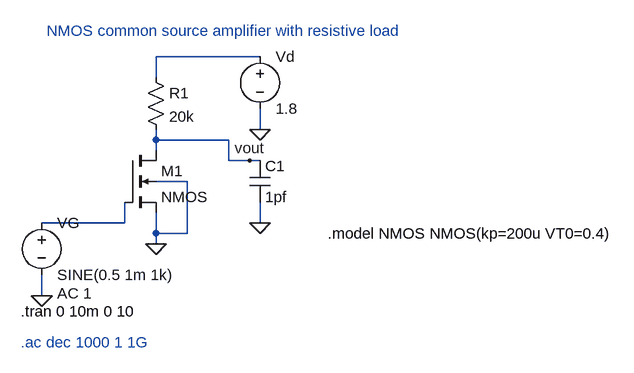
[diagram p0: schematic NMOS common source amplifier with resistive load.asc]
NMOS common source amplifier with resistive load.asc, the LTspice schematic file:
Version 4
SHEET 1 892 680
WIRE 320 0 160 0
WIRE 160 32 160 0
WIRE 320 112 320 80
WIRE 160 128 160 112
WIRE 272 128 160 128
WIRE 160 144 160 128
WIRE 272 160 272 128
WIRE 304 160 272 160
WIRE 320 160 304 160
WIRE 208 192 160 192
WIRE 112 256 112 224
WIRE 112 256 -16 256
WIRE 320 256 320 224
WIRE 160 272 160 240
WIRE 208 272 208 192
WIRE 208 272 160 272
WIRE 160 288 160 272
WIRE -16 368 -16 336
FLAG 160 288 0
FLAG 320 112 0
FLAG 320 256 0
FLAG -16 368 0
FLAG 304 160 vout
SYMBOL nmos4 112 144 R0
SYMATTR InstName M1
SYMATTR Value2 l=1u w=144u
SYMBOL voltage -16 240 R0
WINDOW 123 24 124 Left 2
WINDOW 39 0 0 Left 0
SYMATTR InstName VG
SYMATTR Value SINE(0.5 1m 1k)
SYMATTR Value2 AC 1
SYMBOL voltage 320 -16 R0
WINDOW 123 0 0 Left 0
WINDOW 39 0 0 Left 0
SYMATTR InstName Vd
SYMATTR Value 1.8
SYMBOL res 144 16 R0
SYMATTR InstName R1
SYMATTR Value 20k
SYMBOL cap 304 160 R0
SYMATTR InstName C1
SYMATTR Value 1pf
TEXT -48 392 Left 2 !.tran 0 10m 0 10
TEXT 424 272 Left 2 !.model NMOS NMOS(kp=200u VT0=0.4)
TEXT -8 -40 Left 2 ;NMOS common source amplifier with resistive load
TEXT -48 440 Left 2 ;.ac dec 1000 1 1G

The netlist it stands for:
* NMOS common source amplifier with resistive load.asc
M1 vout N002 0 0 NMOS l=1u w=144u
VG N002 0 SINE(0.5 1m 1k) AC 1
Vd N001 0 1.8
R1 N001 vout 20k
C1 vout 0 1pf
.model NMOS NMOS
.model PMOS PMOS
.lib standard.mos
.tran 0 10m 0 10
.model NMOS NMOS(kp=200u VT0=0.4)
* NMOS common source amplifier with resistive load
* .ac dec 1000 1 1G
.backanno
.end